# EAGLE schematic ps2 (EAGLE 7.5.0)
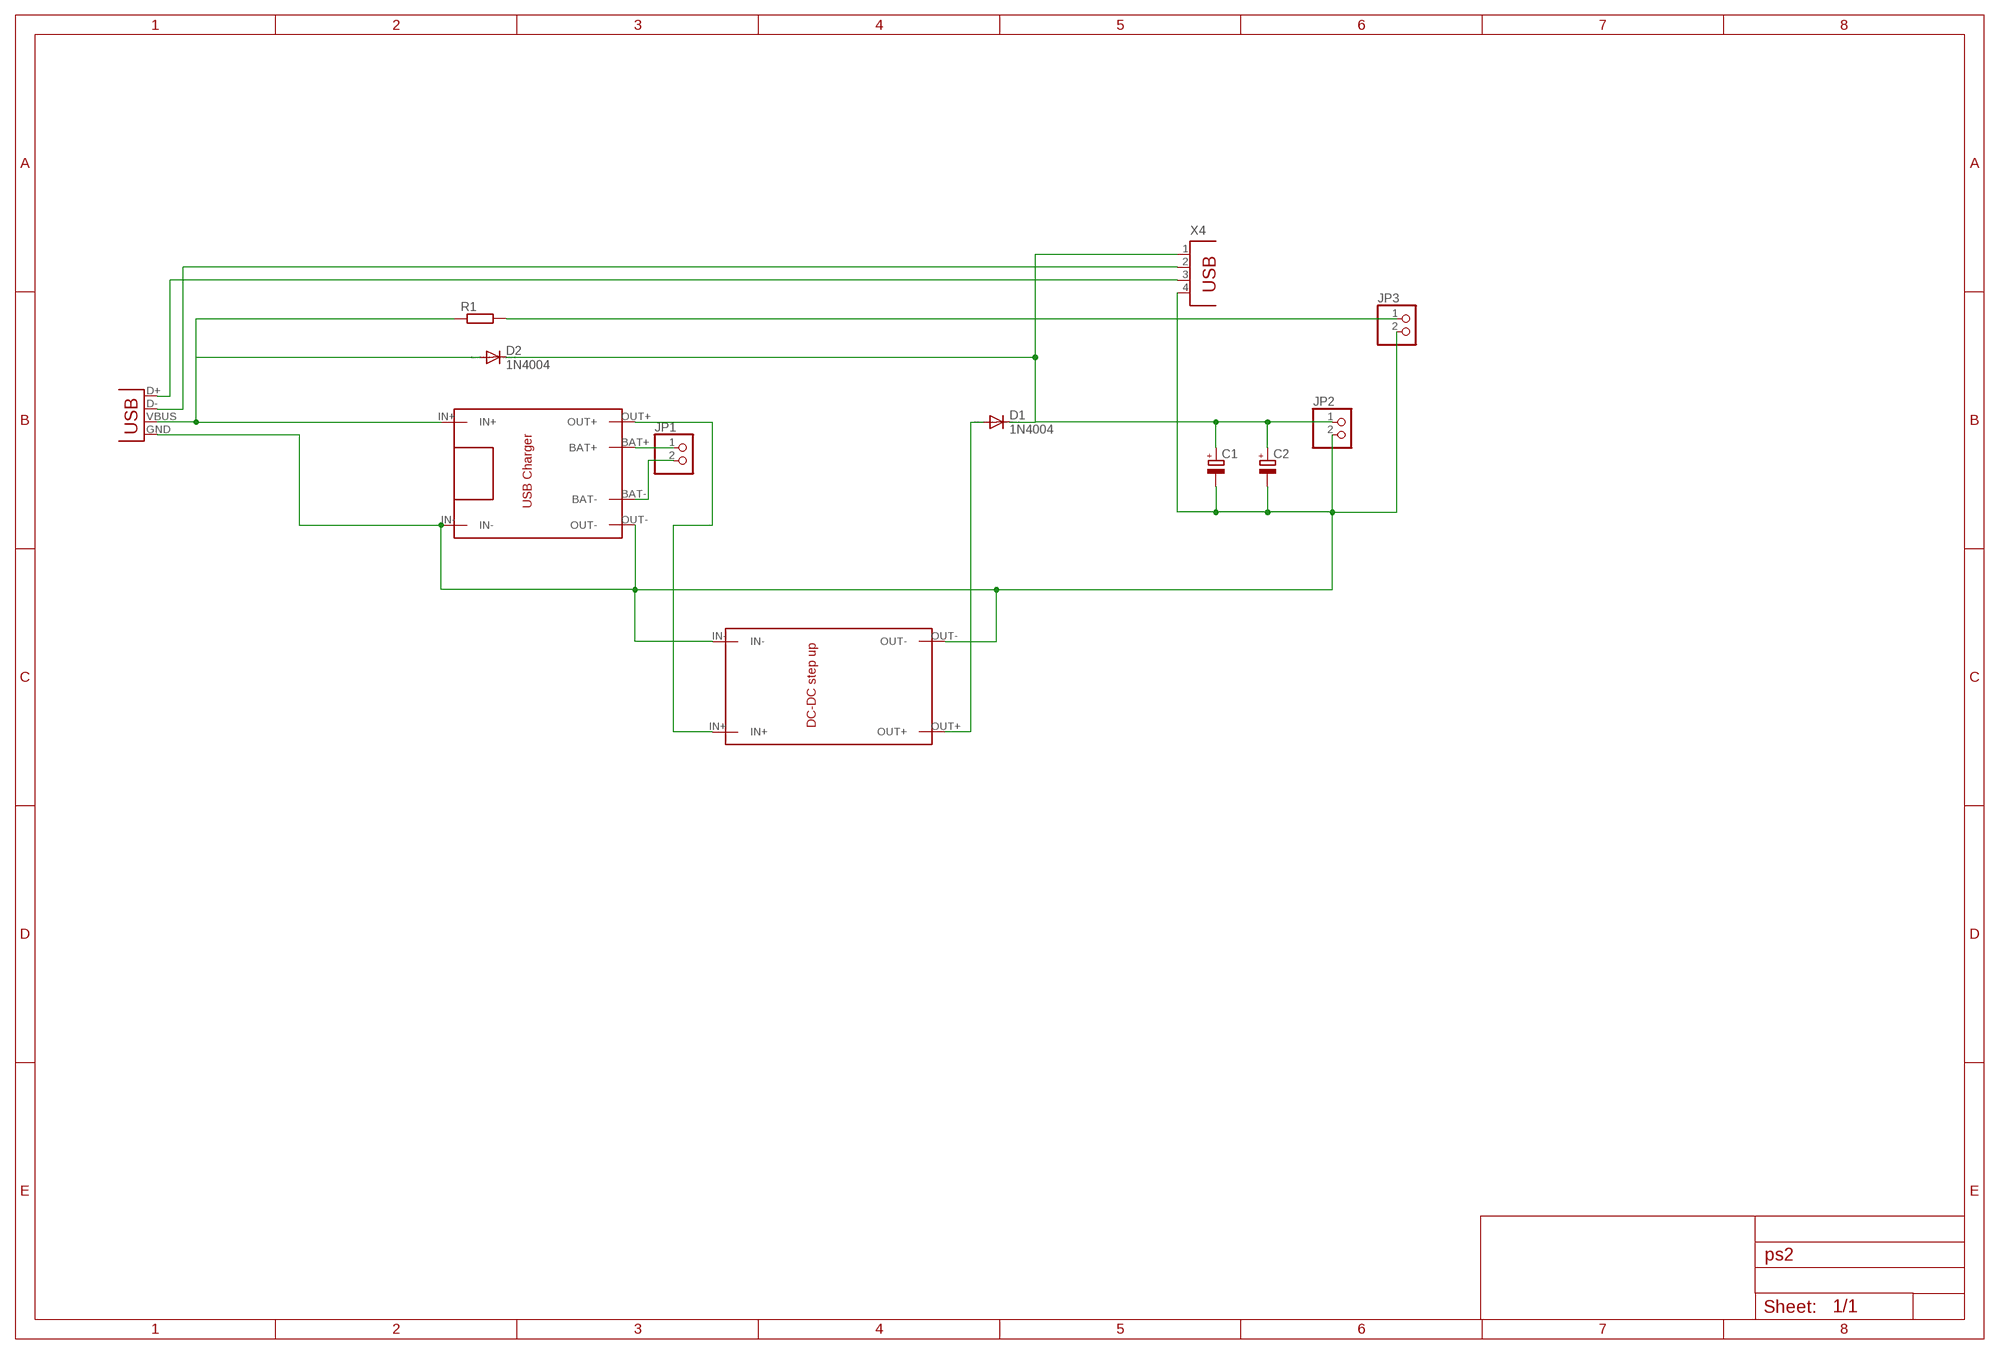
[diagram p0: schematic, sheet 1]

## Parts
C1  CPOL-EUE5-10.5  [E5-10,5]
C2  CPOL-EUE5-10.5  [E5-10,5]
D1  1N4004  [DO41-10]
D2  1N4004  [DO41-10]
JP1  PINHD-1X2  [1X02]
JP2  PINHD-1X2  [1X02]
JP3  PINHD-1X2  [1X02]
R1  R-EU_0207/10  [0207/10]
U$1  TP4056  [TP4056]
U$3  DC-DC_STEPUP  [DC-DC_STEPUP]
X3  USBPTH  [USB-B-PTH]
X4  PN87520  [PN87520]

## Nets
N$1: D2.A R1.1 U$1.IN+ X3.VBUS
N$2: U$1.OUT+ U$3.IN+
N$3: C1.- C2.- JP2.2 JP3.2 U$1.IN- U$1.OUT- U$3.IN- U$3.OUT- X3.GND X4.4
N$6: JP1.1 U$1.BAT+
N$7: JP1.2 U$1.BAT-
N$8: D1.A U$3.OUT+
N$9: C1.+ C2.+ D1.C D2.C JP2.1 X4.1
N$12: JP3.1 R1.2
N$13: X3.D+ X4.3
N$14: X3.D- X4.2

## Library data of the parts
C1 C2 = resistor:CPOL-EU: POLARIZED CAPACITOR, European symbol
D1 D2 = diode:1N4004: DIODE general purpose rectifier, 1 A
JP1-JP3 = pinhead:PINHD-1X2: PIN HEADER
R1 = resistor:R-EU_: RESISTOR, European symbol
U$1 = TP4056 charging module with protection:TP4056
U$3 = DC-DC step up 2:DC-DC_STEPUP
X3 = usb:USB: USB Connectors USB-B-PTH is fully proven SKU : PRT-00139 USB-miniB is fully proven SKU : PRT-00587 USB-A-PCB is untested. USB-A-H is throughly reviewed, but untested. Spark Fun Electronics SKU : PRT-00437 USB-B-SMT is throughly reviewed, but untested. Needs silkscreen touching up. USB-A-S has not been used/tested USB-MB-H has not been used/tested
X4 = con-berg:PN87520: BERG USB connector; OC_FARNELL: unknown; OC_NEWARK: unknown